# Altium schematic sheet EthernetBridge.SchDoc: Main Flight Computer Ethernet Bridge
size A2; Organization: Brickworks; Address1: Matthew Glazer; Address2: Design Engineer; Revision: 1A; SheetNumber: 4; SheetTotal: 7
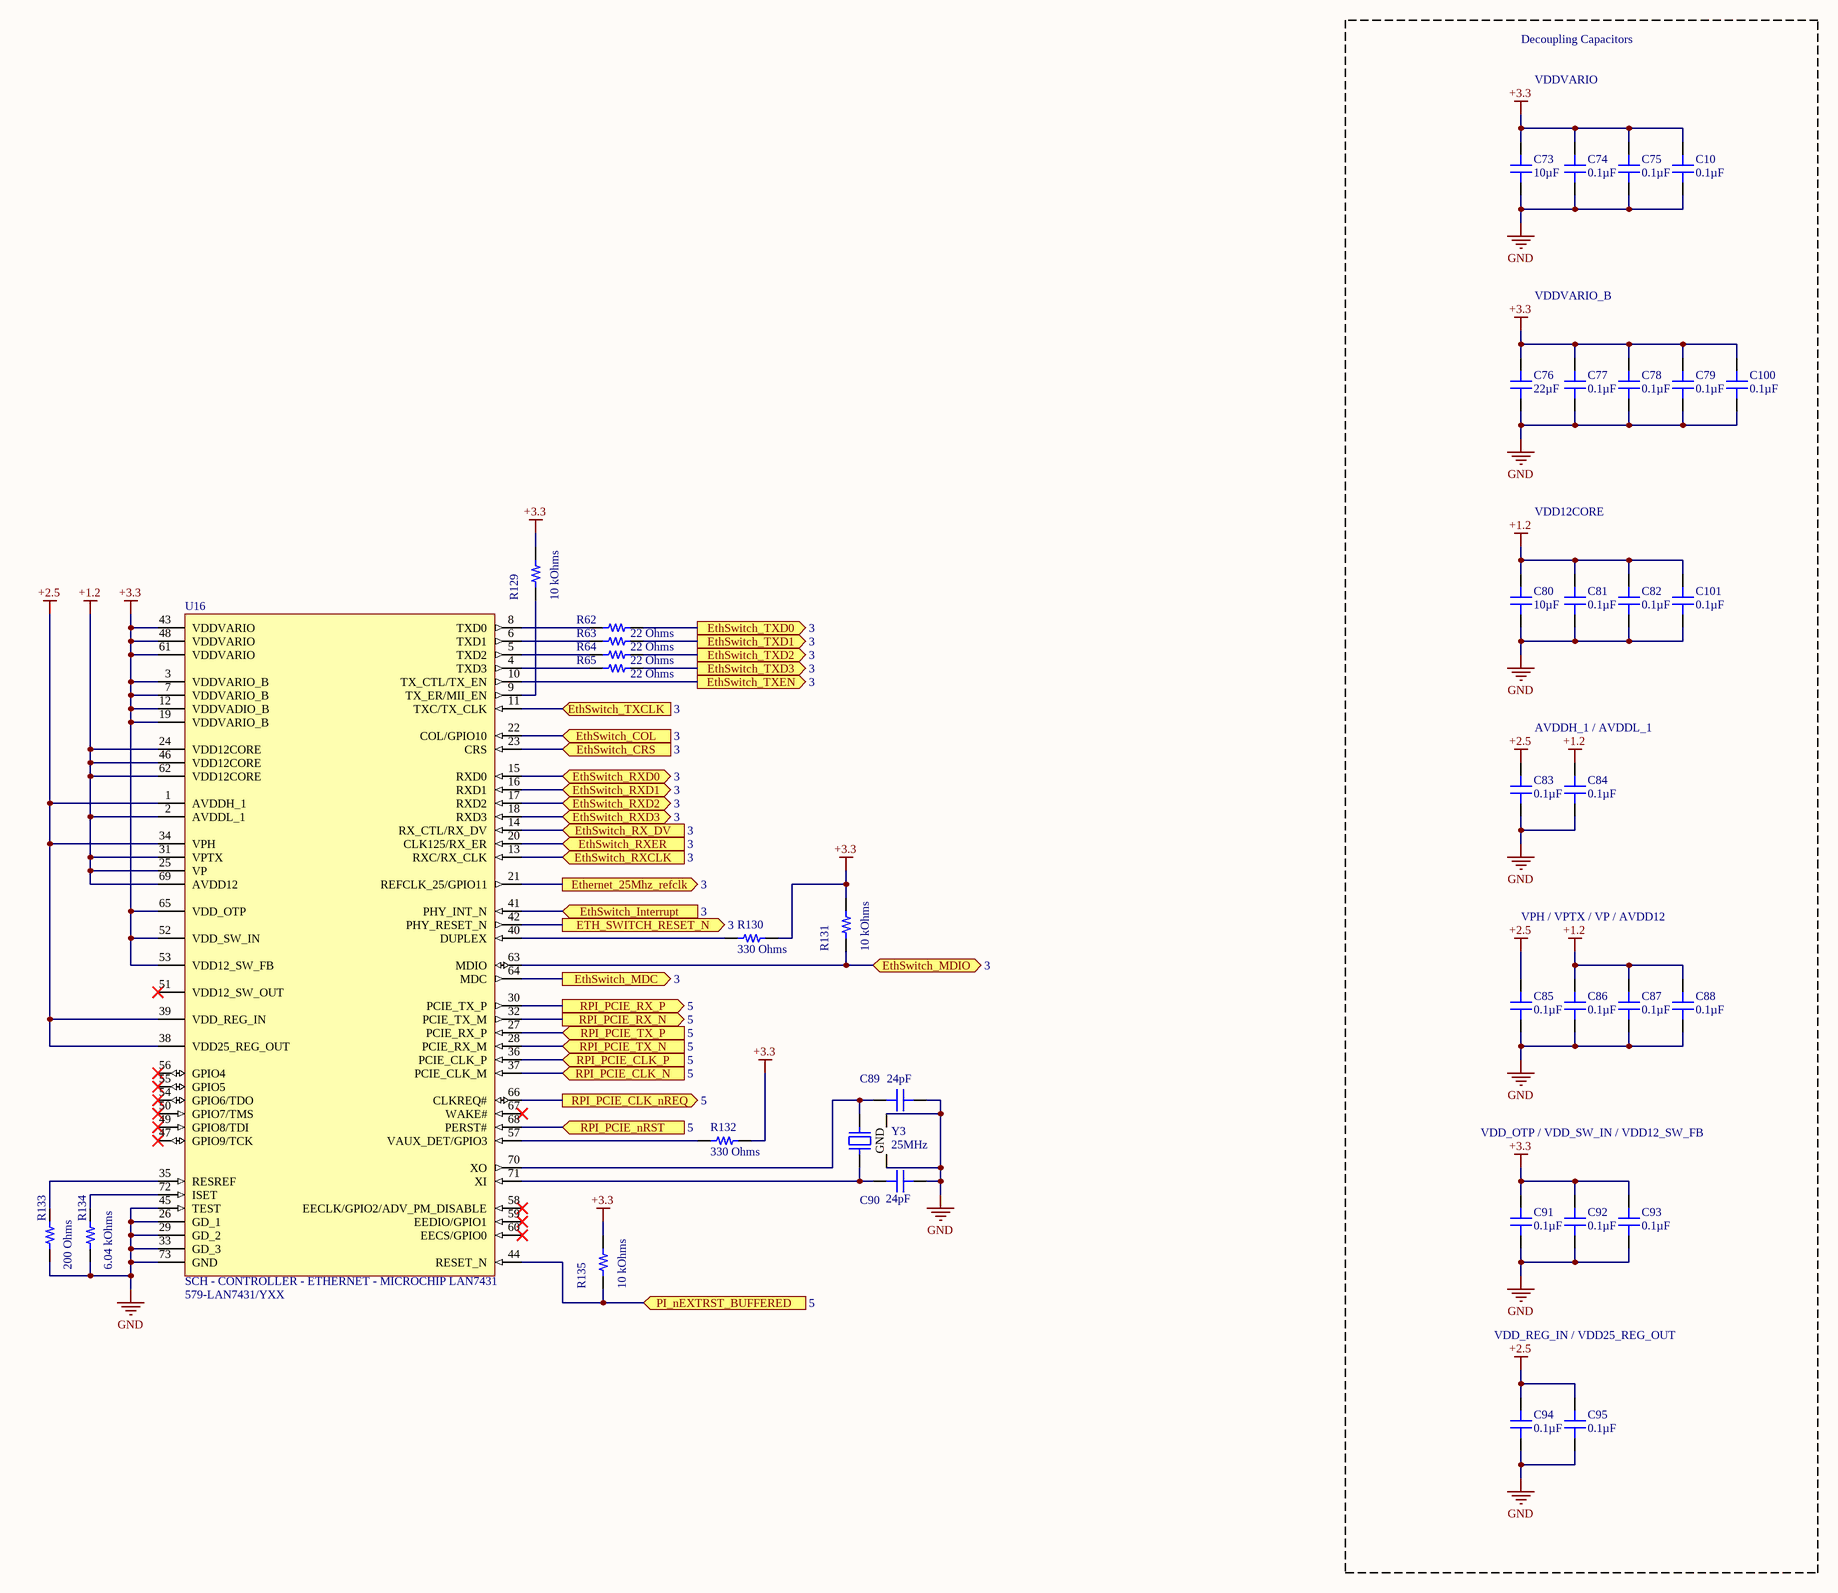
[diagram p0: EthernetBridge.SchDoc]

## Parts
C10  0.1µF  [CAP 0603_1608]
C73  10µF  [CAP 0805_2012]
C74  0.1µF  [CAP 0603_1608]
C75  0.1µF  [CAP 0603_1608]
C76  22µF  [CAP 0805_2012]
C77  0.1µF  [CAP 0603_1608]
C78  0.1µF  [CAP 0603_1608]
C79  0.1µF  [CAP 0603_1608]
C80  10µF  [CAP 0805_2012]
C81  0.1µF  [CAP 0603_1608]
C82  0.1µF  [CAP 0603_1608]
C83  0.1µF  [CAP 0603_1608]
C84  0.1µF  [CAP 0603_1608]
C85  0.1µF  [CAP 0603_1608]
C86  0.1µF  [CAP 0603_1608]
C87  0.1µF  [CAP 0603_1608]
C88  0.1µF  [CAP 0603_1608]
C89  24pF  [CAP 0603_1608]
C90  24pF  [CAP 0603_1608]
C91  0.1µF  [CAP 0603_1608]
C92  0.1µF  [CAP 0603_1608]
C93  0.1µF  [CAP 0603_1608]
C94  0.1µF  [CAP 0603_1608]
C95  0.1µF  [CAP 0603_1608]
C100  0.1µF  [CAP 0603_1608]
C101  0.1µF  [CAP 0603_1608]
R62  22 Ohms  [RES 0603_1608]
R63  22 Ohms  [RES 0603_1608]
R64  22 Ohms  [RES 0603_1608]
R65  22 Ohms  [RES 0603_1608]
R129  10 kOhms  [RES 0603_1608]
R130  330 Ohms  [RES 0603_1608]
R131  10 kOhms  [RES 0603_1608]
R132  330 Ohms  [RES 0603_1608]
R133  200 Ohms  [RES 0603_1608]
R134  6.04 kOhms  [RES 0603_1608]
R135  10 kOhms  [RES 0603_1608]
U16  SCH - CONTROLLER - ETHERNET - MICROCHIP LAN7431  Supplier Part Number 1: 579-LAN7431/YXX  [PCB - LEADLESS - QFN - MICROCHIP 72-SQFN]
Y3  25MHz  [EPSON TSX-3225]

## Ports
ETH_SWITCH_RESET_N (out, see 3), Ethernet_25Mhz_refclk (out, see 3), EthSwitch_COL (in, see 3), EthSwitch_CRS (in, see 3), EthSwitch_Interrupt (in, see 3), EthSwitch_MDC (out, see 3), EthSwitch_MDIO (bidir, see 3), EthSwitch_RX_DV (in, see 3), EthSwitch_RXCLK (in, see 3), EthSwitch_RXD0 (bidir, see 3), EthSwitch_RXD1 (bidir, see 3), EthSwitch_RXD2 (bidir, see 3), EthSwitch_RXD3 (bidir, see 3), EthSwitch_RXER (in, see 3), EthSwitch_TXCLK (in, see 3), EthSwitch_TXD0 (out, see 3), EthSwitch_TXD1 (out, see 3), EthSwitch_TXD2 (out, see 3), EthSwitch_TXD3 (out, see 3), EthSwitch_TXEN (out, see 3), PI_nEXTRST_BUFFERED (in, see 5), RPI_PCIE_CLK_N (in, see 5), RPI_PCIE_CLK_nREQ (out, see 5), RPI_PCIE_CLK_P (in, see 5), RPI_PCIE_nRST (in, see 5), RPI_PCIE_RX_N (out, see 5), RPI_PCIE_RX_P (out, see 5), RPI_PCIE_TX_N (in, see 5), RPI_PCIE_TX_P (in, see 5)

## Nets
+1.2: C80.2 C81.2 C82.2 C84.2 C86.2 C87.2 C88.2 C101.2 U16.2(AVDDL_1) U16.24(VDD12CORE) U16.25(VP) U16.31(VPTX) U16.46(VDD12CORE) U16.62(VDD12CORE) U16.69(AVDD12)
+2.5: C83.2 C85.2 C94.2 C95.2 U16.1(AVDDH_1) U16.34(VPH) U16.38(VDD25_REG_OUT) U16.39(VDD_REG_IN)
+3.3: C10.2 C73.2 C74.2 C75.2 C76.2 C77.2 C78.2 C79.2 C91.2 C92.2 C93.2 C100.2 R129.2 R130.1 R131.2 R132.2 R135.2 U16.3(VDDVARIO_B) U16.7(VDDVARIO_B) U16.12(VDDVADIO_B) U16.19(VDDVARIO_B) U16.43(VDDVARIO) U16.48(VDDVARIO) U16.52(VDD_SW_IN) U16.53(VDD12_SW_FB) U16.61(VDDVARIO) U16.65(VDD_OTP)
GND: C10.1 C73.1 C74.1 C75.1 C76.1 C77.1 C78.1 C79.1 C80.1 C81.1 C82.1 C83.1 C84.1 C85.1 C86.1 C87.1 C88.1 C89.2 C90.2 C91.1 C92.1 C93.1 C94.1 C95.1 C100.1 C101.1 R133.1 R134.1 U16.26(GD_1) U16.29(GD_2) U16.33(GD_3) U16.45(TEST) U16.73(GND) Y3.2(GND) Y3.4(GND)
ETH_SWITCH_RESET_N: U16.42(PHY_RESET_N) ; port ETH_SWITCH_RESET_N
Ethernet_25Mhz_refclk: U16.21(REFCLK_25/GPIO11) ; port Ethernet_25Mhz_refclk
EthSwitch_COL: U16.22(COL/GPIO10) ; port EthSwitch_COL
EthSwitch_CRS: U16.23(CRS) ; port EthSwitch_CRS
EthSwitch_Interrupt: U16.41(PHY_INT_N) ; port EthSwitch_Interrupt
EthSwitch_MDC: U16.64(MDC) ; port EthSwitch_MDC
EthSwitch_MDIO: R131.1 U16.63(MDIO) ; port EthSwitch_MDIO
EthSwitch_RX_DV: U16.14(RX_CTL/RX_DV) ; port EthSwitch_RX_DV
EthSwitch_RXCLK: U16.13(RXC/RX_CLK) ; port EthSwitch_RXCLK
EthSwitch_RXD0: U16.15(RXD0) ; port EthSwitch_RXD0
EthSwitch_RXD1: U16.16(RXD1) ; port EthSwitch_RXD1
EthSwitch_RXD2: U16.17(RXD2) ; port EthSwitch_RXD2
EthSwitch_RXD3: U16.18(RXD3) ; port EthSwitch_RXD3
EthSwitch_RXER: U16.20(CLK125/RX_ER) ; port EthSwitch_RXER
EthSwitch_TXCLK: U16.11(TXC/TX_CLK) ; port EthSwitch_TXCLK
EthSwitch_TXD0: R62.2 ; port EthSwitch_TXD0
EthSwitch_TXD1: R63.2 ; port EthSwitch_TXD1
EthSwitch_TXD2: R64.2 ; port EthSwitch_TXD2
EthSwitch_TXD3: R65.2 ; port EthSwitch_TXD3
EthSwitch_TXEN: U16.10(TX_CTL/TX_EN) ; port EthSwitch_TXEN
PI_nEXTRST_BUFFERED: R135.1 U16.44(RESET_N) ; port PI_nEXTRST_BUFFERED
RPI_PCIE_CLK_N: U16.37(PCIE_CLK_M) ; port RPI_PCIE_CLK_N
RPI_PCIE_CLK_nREQ: U16.66(CLKREQ#) ; port RPI_PCIE_CLK_nREQ
RPI_PCIE_CLK_P: U16.36(PCIE_CLK_P) ; port RPI_PCIE_CLK_P
RPI_PCIE_nRST: U16.68(PERST#) ; port RPI_PCIE_nRST
RPI_PCIE_RX_N: U16.32(PCIE_TX_M) ; port RPI_PCIE_RX_N
RPI_PCIE_RX_P: U16.30(PCIE_TX_P) ; port RPI_PCIE_RX_P
RPI_PCIE_TX_N: U16.28(PCIE_RX_M) ; port RPI_PCIE_TX_N
RPI_PCIE_TX_P: U16.27(PCIE_RX_P) ; port RPI_PCIE_TX_P
NetC89_1: C89.1 U16.70(XO) Y3.3
NetC90_1: C90.1 U16.71(XI) Y3.1
NetR62_1: R62.1 U16.8(TXD0)
NetR63_1: R63.1 U16.6(TXD1)
NetR64_1: R64.1 U16.5(TXD2)
NetR65_1: R65.1 U16.4(TXD3)
NetR129_1: R129.1 U16.9(TX_ER/MII_EN)
NetR130_2: R130.2 U16.40(DUPLEX)
NetR132_1: R132.1 U16.57(VAUX_DET/GPIO3)
NetR133_2: R133.2 U16.35(RESREF)
NetR134_2: R134.2 U16.72(ISET)

Not connected (* = marked no-connect by the designer): U16 47(GPIO9/TCK)* 49(GPIO8/TDI)* 50(GPIO7/TMS)* 51(VDD12_SW_OUT)* 54(GPIO6/TDO)* 55(GPIO5)* 56(GPIO4)* 58(EECLK/GPIO2/ADV_PM_DISABLE)* 59(EEDIO/GPIO1)* 60(EECS/GPIO0)* 67(WAKE#)*

## Notes on the sheet
- Decoupling Capacitors
- VDDVARIO
- VDDVARIO_B
- VDD12CORE
- AVDDH_1 / AVDDL_1
- VPH / VPTX / VP / AVDD12
- VDD_OTP / VDD_SW_IN / VDD12_SW_FB
- VDD_REG_IN / VDD25_REG_OUT
- Title
- Size:
- Date:
- File:
- A2
- Number:
- Time:
- Revision:
- Sheet
- of

## Library data of the parts
C10 C74 C75 C77-C79 C81-C88 C91-C95 C100 C101 = CL10B104KA8WPNC: CAP CER 0.1UF 25V X7R 0603; Manufacturer: Samsung Electro-Mechanics; Tolerance: ±10%; Part Number: CL10B104KA8WPNC; Value: 0.1µF; Applications: Automotive; Capacitance: 0.1µF; ComponentLink1Description: Datasheet; ComponentLink1URL: http://www.samsungsem.com/kr/support/product-search/mlcc/CL10B104KA8WPNC.jsp; ComponentLink2Description: DigiKey Link; ComponentLink2URL: http://digikey.com/product-detail/en/samsung-electro-mechanics/CL10B104KA8WPNC/1276-6717-1-ND/5961576; Device Package: 0603 (1608 Metric); Features: Open Mode; LastUpdated: 9/2/2020 1:03:30 AM; Lifecycle Status: Active; Minimum Order: 1; Mounting Type: Surface Mount, MLCC; Operating Temperature: -55°C ~ 125°C; Package / Case: 0603 (1608 Metric); Packaging: TapeAndReel; PartId: 5631; Part Status: Active; Price: 0.02; Ratings: AEC-Q200; Series: CL; Size / Dimension: 0.063" L x 0.031" W (1.60mm x 0.80mm); Supplier 1: DigiKey; Supplier Part Number 1: 1276-6717-1-ND; Temperature Coefficient: X7R; Thickness (Max): 0.035" (0.90mm); Voltage - Rated: 25V
C73 C80 = CC0805KKX5R7BB106: CAP CER 10UF 16V X5R 0805; Manufacturer: Yageo; Tolerance: ±10%; Part Number: CC0805KKX5R7BB106; Value: 10µF; Applications: General Purpose; Capacitance: 10µF; ComponentLink1Description: Datasheet; ComponentLink1URL: https://www.yageo.com/upload/media/product/productsearch/datasheet/mlcc/UPY-GPHC_X5R_4V-to-50V_25.pdf; ComponentLink2Description: DigiKey Link; ComponentLink2URL: http://digikey.com/product-detail/en/yageo/CC0805KKX5R7BB106/311-1865-1-ND/5195767; Device Package: 0805 (2012 Metric); LastUpdated: 9/2/2020 1:04:30 AM; Lifecycle Status: Active; Minimum Order: 1; Mounting Type: Surface Mount, MLCC; Operating Temperature: -55°C ~ 85°C; Package / Case: 0805 (2012 Metric); Packaging: TapeAndReel; PartId: 8867; Part Status: Active; Price: 0.09; Series: CC; Size / Dimension: 0.079" L x 0.049" W (2.00mm x 1.25mm); Supplier 1: DigiKey; Supplier Part Number 1: 311-1865-1-ND; Temperature Coefficient: X5R; Thickness (Max): 0.057" (1.45mm); Voltage - Rated: 16V
C76 = CL21A226KPCLRNC: CAP CER 22UF 10V X5R 0805; Manufacturer: Samsung Electro-Mechanics; Tolerance: ±10%; Part Number: CL21A226KPCLRNC; Value: 22µF; Applications: General Purpose; Capacitance: 22µF; ComponentLink1Description: Datasheet; ComponentLink1URL: http://www.samsungsem.com/kr/support/product-search/mlcc/CL21A226KPCLRNC.jsp; ComponentLink2Description: DigiKey Link; ComponentLink2URL: http://digikey.com/product-detail/en/samsung-electro-mechanics/CL21A226KPCLRNC/1276-6786-1-ND/5961645; Device Package: 0805 (2012 Metric); Features: Low Profile; LastUpdated: 9/2/2020 1:04:38 AM; Lifecycle Status: Active; Minimum Order: 1; Mounting Type: Surface Mount, MLCC; Operating Temperature: -55°C ~ 85°C; Package / Case: 0805 (2012 Metric); Packaging: TapeAndReel; PartId: 4833; Part Status: Active; Price: 0.08; Series: CL; Size / Dimension: 0.079" L x 0.049" W (2.00mm x 1.25mm); Supplier 1: DigiKey; Supplier Part Number 1: 1276-6786-1-ND; Temperature Coefficient: X5R; Thickness (Max): 0.037" (0.95mm); Voltage - Rated: 10V
C89 C90 = CL10C240JB8NNNC: CAP CER 24PF 50V C0G/NP0 0603; Manufacturer: Samsung Electro-Mechanics; Temperature Coefficient: C0G, NP0; Tolerance: ±5%; Part Number: CL10C240JB8NNNC; Value: 24pF; Applications: General Purpose; Capacitance: 24pF; ComponentLink1Description: Datasheet; ComponentLink1URL: http://www.samsungsem.com/kr/support/product-search/mlcc/CL10C240JB8NNNC.jsp; ComponentLink2Description: DigiKey Link; ComponentLink2URL: http://digikey.com/product-detail/en/samsung-electro-mechanics/CL10C240JB8NNNC/1276-1761-1-ND/3889847; Device Package: 0603 (1608 Metric); LastUpdated: 9/2/2020 1:03:22 AM; Lifecycle Status: Active; Minimum Order: 1; Mounting Type: Surface Mount, MLCC; Operating Temperature: -55°C ~ 125°C; Package / Case: 0603 (1608 Metric); Packaging: TapeAndReel; PartId: 10003; Part Status: Active; Price: 0.01; Series: CL; Size / Dimension: 0.063" L x 0.031" W (1.60mm x 0.80mm); Supplier 1: DigiKey; Supplier Part Number 1: 1276-1761-1-ND; Thickness (Max): 0.035" (0.90mm); Voltage - Rated: 50V
R62-R65 = RMCF0603FT22R0: RES 22 OHM 1% 1/10W 0603; Manufacturer: Stackpole Electronics Inc; Power (Watts): 0.1W, 1/10W; Temperature Coefficient: ±100ppm/°C; Part Number: RMCF0603FT22R0; Value: 22 Ohms; ComponentLink1Description: Datasheet; ComponentLink1URL: https://www.seielect.com/catalog/sei-packaging.pdf; ComponentLink2Description: DigiKey Link; ComponentLink2URL: http://digikey.com/product-detail/en/stackpole-electronics-inc/RMCF0603FT22R0/RMCF0603FT22R0CT-ND/1942946; Composition: Thick Film; Device Package: 0603 (1608 Metric); Features: Automotive AEC-Q200; Height - Seated (Max): 0.022" (0.55mm); LastUpdated: 9/2/2020 1:10:13 AM; Lifecycle Status: Active; Minimum Order: 1; Number of Terminations: 2; Operating Temperature: -55°C ~ 155°C; Package / Case: 0603 (1608 Metric); Packaging: CutTape; PartId: 10611; Part Status: Active; Price: 0.10; Ratings: AEC-Q200; Resistance: 22 Ohms; Series: RMCF; Size / Dimension: 0.061" L x 0.031" W (1.55mm x 0.80mm); Supplier 1: DigiKey; Supplier Part Number 1: RMCF0603FT22R0CT-ND; Supplier Device Package: 0603; Tolerance: ±1%
R129 R131 R135 = RMCF0603JT10K0: RES 10K OHM 5% 1/10W 0603; Manufacturer: Stackpole Electronics Inc; Power (Watts): 0.1W, 1/10W; Temperature Coefficient: ±200ppm/°C; Part Number: RMCF0603JT10K0; Value: 10 kOhms; ComponentLink1Description: Datasheet; ComponentLink1URL: https://www.seielect.com/catalog/sei-packaging.pdf; ComponentLink2Description: DigiKey Link; ComponentLink2URL: http://digikey.com/product-detail/en/stackpole-electronics-inc/RMCF0603JT10K0/RMCF0603JT10K0CT-ND/1943191; Composition: Thick Film; Device Package: 0603 (1608 Metric); Features: Automotive AEC-Q200; Height - Seated (Max): 0.022" (0.55mm); LastUpdated: 9/2/2020 1:09:31 AM; Lifecycle Status: Active; Minimum Order: 1; Number of Terminations: 2; Operating Temperature: -55°C ~ 155°C; Package / Case: 0603 (1608 Metric); Packaging: CutTape; PartId: 25659; Part Status: Active; Price: 0.10; Ratings: AEC-Q200; Resistance: 10 kOhms; Series: RMCF; Size / Dimension: 0.061" L x 0.031" W (1.55mm x 0.80mm); Supplier 1: DigiKey; Supplier Part Number 1: RMCF0603JT10K0CT-ND; Supplier Device Package: 0603; Tolerance: ±5%
R130 R132 = RMCF0603FT330R: RES 330 OHM 1% 1/10W 0603; Manufacturer: Stackpole Electronics Inc; Power (Watts): 0.1W, 1/10W; Temperature Coefficient: ±100ppm/°C; Part Number: RMCF0603FT330R; Value: 330 Ohms; ComponentLink1Description: Datasheet; ComponentLink1URL: https://www.seielect.com/catalog/sei-rmcf_rmcp.pdf; ComponentLink2Description: DigiKey Link; ComponentLink2URL: http://digikey.com/product-detail/en/stackpole-electronics-inc/RMCF0603FT330R/RMCF0603FT330RCT-ND/1942981; Composition: Thick Film; Device Package: 0603 (1608 Metric); Features: Automotive AEC-Q200; Height - Seated (Max): 0.022" (0.55mm); LastUpdated: 9/2/2020 1:10:13 AM; Lifecycle Status: Active; Minimum Order: 1; Number of Terminations: 2; Operating Temperature: -55°C ~ 155°C; Package / Case: 0603 (1608 Metric); Packaging: CutTape; PartId: 10615; Part Status: Active; Price: 0.10; Ratings: AEC-Q200; Resistance: 330 Ohms; Series: RMCF; Size / Dimension: 0.061" L x 0.031" W (1.55mm x 0.80mm); Supplier 1: DigiKey; Supplier Part Number 1: RMCF0603FT330RCT-ND; Supplier Device Package: 0603; Tolerance: ±1%
R133 = RMCF0603FT200R: RES 200 OHM 1% 1/10W 0603; Manufacturer: Stackpole Electronics Inc; Power (Watts): 0.1W, 1/10W; Temperature Coefficient: ±100ppm/°C; Part Number: RMCF0603FT200R; Value: 200 Ohms; ComponentLink1Description: Datasheet; ComponentLink1URL: https://www.seielect.com/catalog/sei-packaging.pdf; ComponentLink2Description: DigiKey Link; ComponentLink2URL: http://digikey.com/product-detail/en/stackpole-electronics-inc/RMCF0603FT200R/RMCF0603FT200RCT-ND/1942972; Composition: Thick Film; Device Package: 0603 (1608 Metric); Features: Automotive AEC-Q200; Height - Seated (Max): 0.022" (0.55mm); LastUpdated: 9/2/2020 1:10:13 AM; Lifecycle Status: Active; Minimum Order: 1; Number of Terminations: 2; Operating Temperature: -55°C ~ 155°C; Package / Case: 0603 (1608 Metric); Packaging: CutTape; PartId: 10703; Part Status: Active; Price: 0.10; Ratings: AEC-Q200; Resistance: 200 Ohms; Series: RMCF; Size / Dimension: 0.061" L x 0.031" W (1.55mm x 0.80mm); Supplier 1: DigiKey; Supplier Part Number 1: RMCF0603FT200RCT-ND; Supplier Device Package: 0603; Tolerance: ±1%
R134 = RMCF0603FT6K04: RES 6.04K OHM 1% 1/10W 0603; Manufacturer: Stackpole Electronics Inc; Power (Watts): 0.1W, 1/10W; Temperature Coefficient: ±100ppm/°C; Part Number: RMCF0603FT6K04; Value: 6.04 kOhms; ComponentLink1Description: Datasheet; ComponentLink1URL: https://www.seielect.com/catalog/sei-rmcf_rmcp.pdf; ComponentLink2Description: DigiKey Link; ComponentLink2URL: http://digikey.com/product-detail/en/stackpole-electronics-inc/RMCF0603FT6K04/RMCF0603FT6K04CT-ND/1943041; Composition: Thick Film; Device Package: 0603 (1608 Metric); Features: Automotive AEC-Q200; Height - Seated (Max): 0.022" (0.55mm); LastUpdated: 9/2/2020 1:10:13 AM; Lifecycle Status: Active; Minimum Order: 1; Number of Terminations: 2; Operating Temperature: -55°C ~ 155°C; Package / Case: 0603 (1608 Metric); Packaging: CutTape; PartId: 10873; Part Status: Active; Price: 0.10; Ratings: AEC-Q200; Resistance: 6.04 kOhms; Series: RMCF; Size / Dimension: 0.061" L x 0.031" W (1.55mm x 0.80mm); Supplier 1: DigiKey; Supplier Part Number 1: RMCF0603FT6K04CT-ND; Supplier Device Package: 0603; Tolerance: ±1%
Y3 = TSX-3225 25.0000MF20P-C0: CRYSTAL 25.0000MHZ 18PF SMD; Manufacturer: EPSON; ESR (Equivalent Series Resistance): 40 Ohms; Frequency Stability: ±20ppm; Frequency Tolerance: ±10ppm; Operating Mode: Fundamental; Part Number: TSX-3225 25.0000MF20P-C0; ComponentLink1Description: Datasheet; ComponentLink1URL: https://support.epson.biz/td/api/doc_check.php?dl=brief_TSX-3225&lang=en; ComponentLink2Description: DigiKey Link; ComponentLink2URL: http://digikey.com/product-detail/en/epson/TSX-3225-25.0000MF20P-C0/SER4212CT-ND/7430967; Frequency: 25MHz; Height - Seated (Max): 0.024" (0.60mm); LastUpdated: 9/2/2020 1:21:54 AM; Lifecycle Status: Active; Load Capacitance: 18pF; Minimum Order: 1; Mounting Type: Surface Mount; Operating Temperature: -20°C ~ 85°C; Package / Case: 4-SMD, No Lead; Packaging: TapeAndReel; PartId: 447; Part Status: Active; Price: 0.18; Series: TSX-3225; Size / Dimension: 0.126" L x 0.098" W (3.20mm x 2.50mm); Supplier 1: DigiKey; Supplier Part Number 1: SER4212CT-ND; Type: MHz Crystal; Value: 25MHz
U16 = SCH - CONTROLLER - ETHERNET - MICROCHIP LAN7431: Supplier 1: Mouser